# EAGLE schematic reciever (EAGLE 9.6.2)
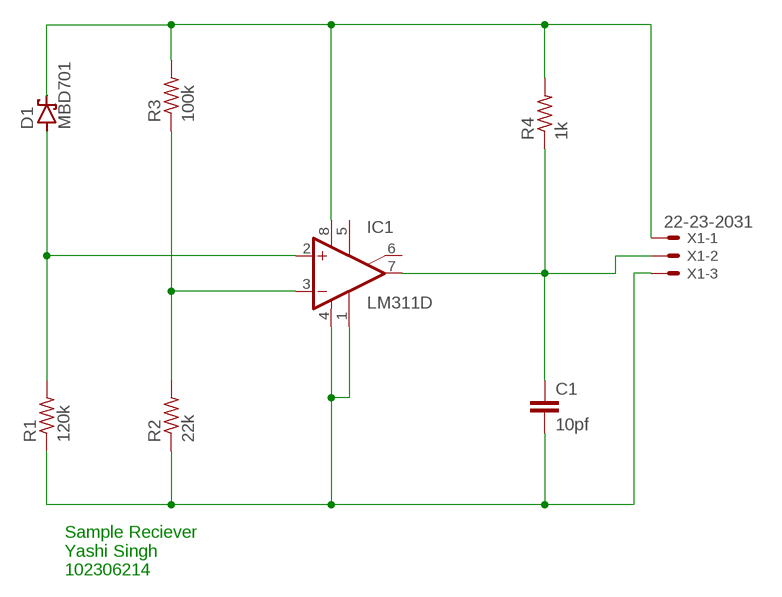
[diagram p0: schematic, sheet 1]

## Parts
C1  10pf  C2.5/2  [C2.5-2]
D1  MBD701  [TO92H]
IC1  LM311D  [SO08]
R1  120k  R-US_0207/10  [0207/10]
R2  22k  R-US_0207/10  [0207/10]
R3  100k  R-US_0207/10  [0207/10]
R4  1k  R-US_0207/10  [0207/10]
X1  22-23-2031  [22-23-2031]

## Nets
N$1: D1.2(C) IC1.8(V+) R3.2 R4.2 X1.1
N$2: D1.1(A) IC1.2(+IN) R1.2
N$3: C1.2 IC1.1(GND) IC1.4(V-) R1.1 R2.1 X1.3
N$4: C1.1 IC1.7(OUT) R4.1 X1.2
N$5: IC1.3(-IN) R2.2 R3.1
Unconnected: IC1.5(ON) IC1.6(ON/STR)

## Notes on the sheet
- Sample Reciever
  Yashi Singh
  102306214

## Library data of the parts
C1 = capacitor-wima:C: CAPACITOR naming: grid - package width
D1 = diode:MBD701: UHF DIODE
IC1 = linear:LM311: COMPARATOR
R1-R4 = rcl:R-US_: RESISTOR, American symbol; SPICEPREFIX: R
X1 = con-molex:22-23-2031: .100" (2.54mm) Center Header - 3 Pin; MF: MOLEX; MPN: 22-23-2031; OC_FARNELL: 1462950; OC_NEWARK: 30C0862